# EAGLE schematic BoB Brain v03 (EAGLE 7.5.0)

## Sheet 1 of 2: LED Controller
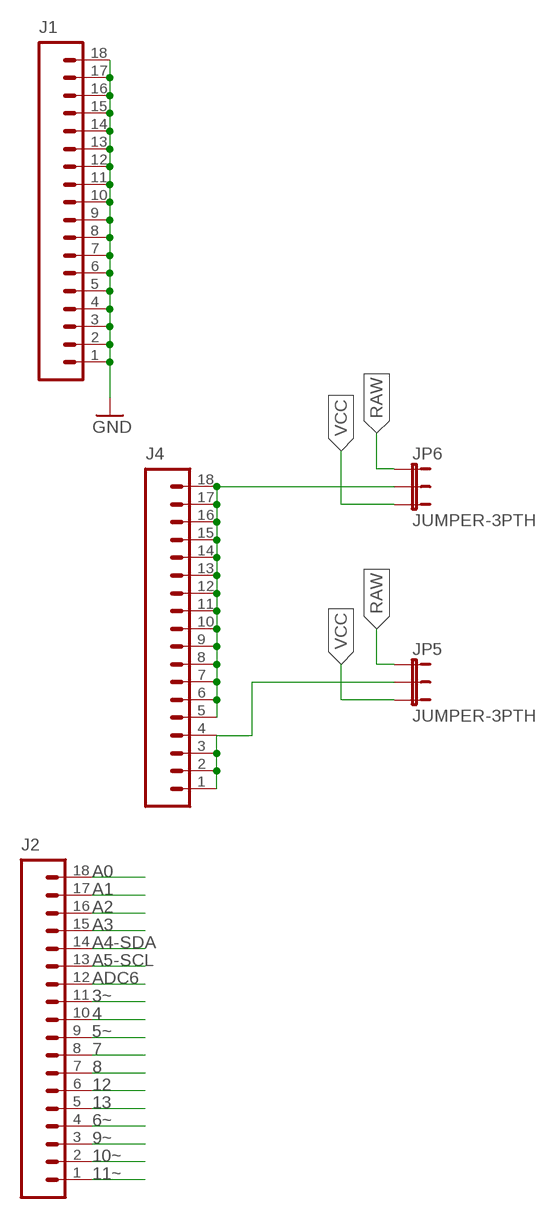
[diagram p0: schematic, sheet 1]

### Parts
J1  M18_  [1X18]
J2  M18_  [1X18]
J4  M18_  [1X18]
JP5  JUMPER-3PTH  [1X03]
JP6  JUMPER-3PTH  [1X03]

### Nets
3~: J2.18 ; also sheet 2
4: J2.17 ; also sheet 2
5~: J2.9 ; also sheet 2
6V: J4.5 J4.6 J4.7 J4.8 J4.9 J4.10 J4.11 J4.12 J4.13 J4.14 J4.15 J4.16 J4.17 J4.18 JP6.2
6~: J2.4 ; also sheet 2
7: J2.8 ; also sheet 2
8: J2.7 ; also sheet 2
9~: J2.3 ; also sheet 2
10~: J2.2 ; also sheet 2
11~: J2.1 ; also sheet 2
12: J2.6 ; also sheet 2
13: J2.5 ; also sheet 2
A0: J2.12 ; also sheet 2
A1: J2.10
A2: J2.16
A3: J2.15 ; also sheet 2
A4-SDA: J2.14 ; also sheet 2
A5-SCL: J2.13 ; also sheet 2
ADC6: J2.11 ; also sheet 2
GND: J1.1 J1.2 J1.3 J1.4 J1.5 J1.6 J1.7 J1.8 J1.9 J1.10 J1.11 J1.12 J1.13 J1.14 J1.15 J1.16 J1.17 J1.18 ; also sheet 2
PIN_PWR: J4.1 J4.2 J4.3 J4.4 JP5.2
RAW: JP5.1 JP6.1 ; also sheet 2
VCC: JP5.3 JP6.3 ; also sheet 2

## Sheet 2 of 2: My Arduino
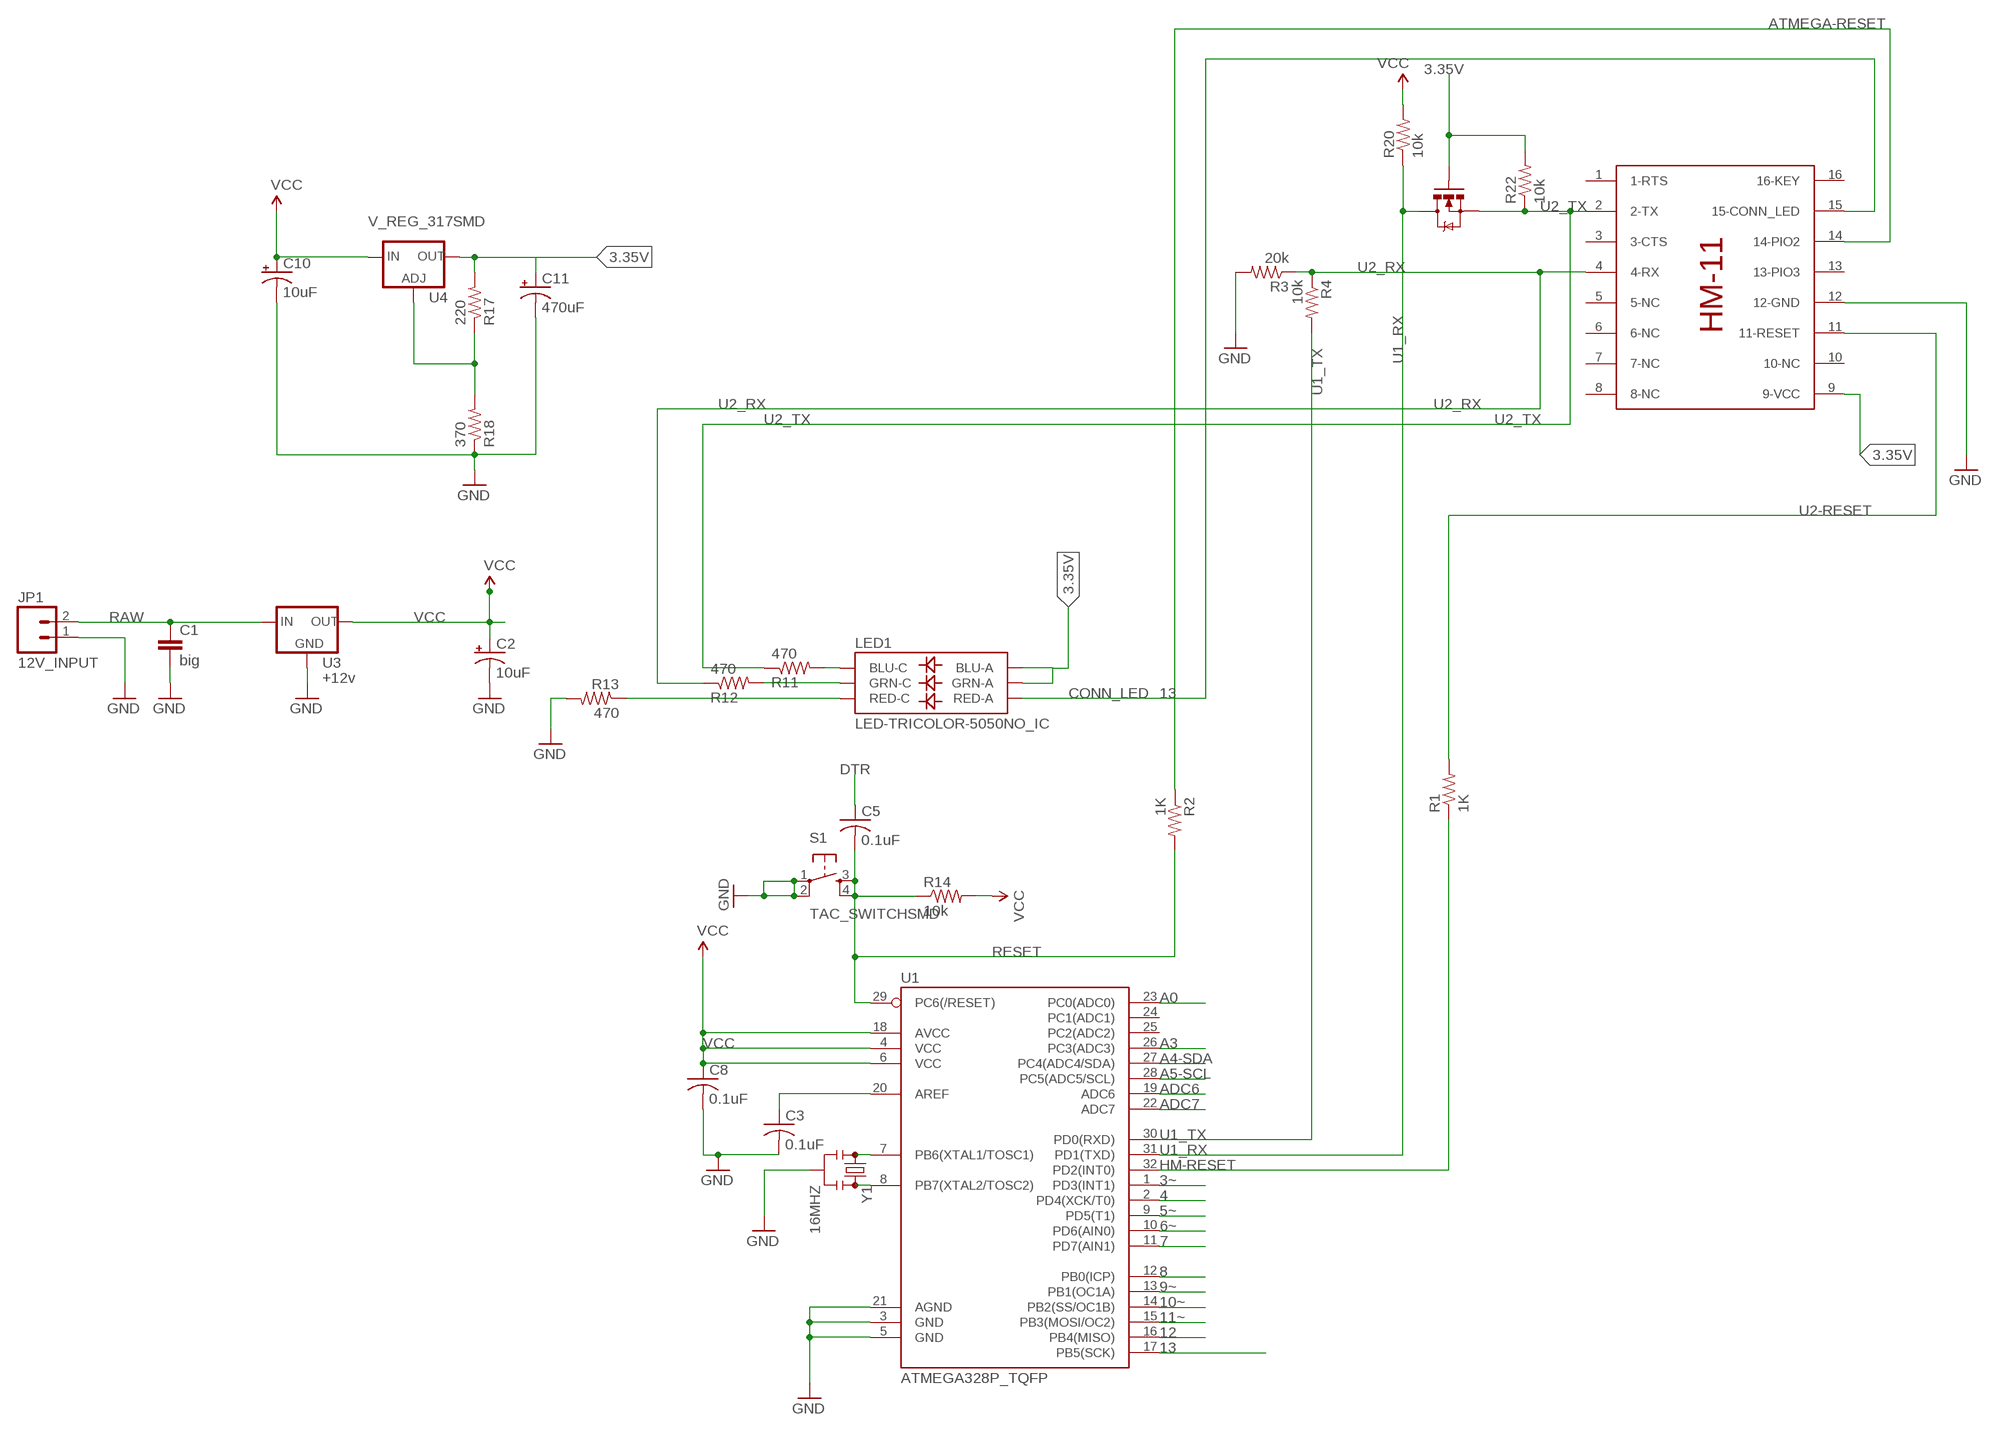
[diagram p1: schematic, sheet 2]

### Parts
C1  big  CAPPTH1  [CAP-PTH-5MM]
C2  10uF  CAP_POL3528  [EIA3528]
C3  0.1uF  C-USC0402  [C0402]
C5  0.1uF  C-USC0805K  [C0805K]
C8  0.1uF  C-USC0402  [C0402]
C10  10uF  CAP_POL3528  [EIA3528]
C11  470uF  CPOL-USD/7343-31W  [D/7343-31W]
JP1  12V_INPUT  M025MM  [SCREWTERMINAL-5MM-2]
LED1  LED-TRICOLOR-5050NO_IC  [LED-TRICOLOR-5050]
Q1  MOSFET-NCHANNELAO3404A  [SOT23-3]
R1  1K  R-US_R0805W  [R0805W]
R2  1K  R-US_R0805W  [R0805W]
R3  20k  R-US_R0805W  [R0805W]
R4  10k  R-US_R0805W  [R0805W]
R11  470  R-US_R0805W  [R0805W]
R12  470  R-US_R0805W  [R0805W]
R13  470  R-US_R0805W  [R0805W]
R14  10k  R-US_R0805W  [R0805W]
R17  220  R-US_R0805W  [R0805W]
R18  370  R-US_R0805W  [R0805W]
R20  10k  R-US_R0805W  [R0805W]
R22  10k  R-US_R0805W  [R0805W]
S1  TAC_SWITCHSMD  [TACTILE-SWITCH-SMD]
U1  ATMEGA328P_TQFP  [TQFP32-08]
U3  +12v  V_REG_78XX7812  [TO-252]
U4  V_REG_317SMD  [SOT223]
U$1  HM-11  [HM-11]
Y1  16MHZ  RESONATOR16MHZ  [RESONATOR-SMD]

### Nets
3.35V: C11.+ LED1.1(GRN-A) LED1.3(BLU-A) Q1.1(G) R17.2 R22.2 U4.2(OUT) U$1.9(9-VCC)
3~: U1.1(PD3(INT1)) ; also sheet 1
4: U1.2(PD4(XCK/T0)) ; also sheet 1
5~: U1.9(PD5(T1)) ; also sheet 1
6~: U1.10(PD6(AIN0)) ; also sheet 1
7: U1.11(PD7(AIN1)) ; also sheet 1
8: U1.12(PB0(ICP)) ; also sheet 1
9~: U1.13(PB1(OC1A)) ; also sheet 1
10~: U1.14(PB2(SS/OC1B)) ; also sheet 1
11~: U1.15(PB3(MOSI/OC2)) ; also sheet 1
12: U1.16(PB4(MISO)) ; also sheet 1
13: U1.17(PB5(SCK)) ; also sheet 1
A0: U1.23(PC0(ADC0)) ; also sheet 1
A3: U1.26(PC3(ADC3)) ; also sheet 1
A4-SDA: U1.27(PC4(ADC4/SDA)) ; also sheet 1
A5-SCL: U1.28(PC5(ADC5/SCL)) ; also sheet 1
ADC6: U1.19(ADC6) ; also sheet 1
ADC7: U1.22(ADC7)
AREF: C3.1 U1.20(AREF)
ATMEGA-RESET: R2.1 U$1.14(14-PIO2)
CONN_LED: LED1.2(RED-A) U$1.15(15-CONN_LED)
DTR: C5.1
GND: C1.2 C2.C(-) C3.2 C8.2 C10.C(-) C11.- JP1.1 R3.2 R13.2 R18.1 S1.1 S1.2 U1.3(GND) U1.5(GND) U1.21(AGND) U3.3(GND) U$1.12(12-GND) Y1.2 ; also sheet 1
HM-RESET: R1.1 U1.32(PD2(INT0))
N$1: LED1.5(RED-C) R13.1
N$2: U1.7(PB6(XTAL1/TOSC1)) Y1.1
N$3: LED1.4(BLU-C) R11.2
N$4: LED1.6(GRN-C) R12.2
N$11: U1.8(PB7(XTAL2/TOSC2)) Y1.3
N$14: R17.1 R18.2 U4.1(ADJ)
RAW: C1.1 JP1.2 U3.1(IN) ; also sheet 1
RESET: C5.2 R2.2 R14.1 S1.3 S1.4 U1.29(PC6(/RESET))
U1_RX: Q1.3(D) R20.1 U1.31(PD1(TXD))
U1_TX: R4.2 U1.30(PD0(RXD))
U2-RESET: R1.2 U$1.11(11-RESET)
U2_RX: R3.1 R4.1 R12.1 U$1.4(4-RX)
U2_TX: Q1.2(S) R11.1 R22.1 U$1.2(2-TX)
VCC: C2.A(+) C8.1 C10.A(+) R14.2 R20.2 U1.4(VCC) U1.6(VCC) U1.18(AVCC) U3.2(OUT) U4.3(IN) ; also sheet 1
Unconnected: U1.24(PC1(ADC1)) U1.25(PC2(ADC2)) U$1.1(1-RTS) U$1.3(3-CTS) U$1.5(5-NC) U$1.6(6-NC) U$1.7(7-NC) U$1.8(8-NC) U$1.10(10-NC) U$1.13(13-PIO3) U$1.16(16-KEY)

## Library data of the parts
C1 = SparkFun-Passives:CAP: Capacitor Standard 0603 ceramic capacitor, and 0.1" leaded capacitor.
C2 C10 = SparkFun-Capacitors:CAP_POL: Capacitor Polarized These are standard SMD and PTH capacitors. Normally 10uF, 47uF, and 100uF in electrolytic and tantalum varieties. Always verify the external diameter of the through hole cap, it varies with capacity, voltage, and manufacturer. The EIA devices should be standard.
C3 C5 C8 = resistor:C-US: CAPACITOR, American symbol
C11 = resistor:CPOL-US: POLARIZED CAPACITOR, American symbol
J1 J2 J4 = SparkFun-Connectors:M18: 1x18 .1" header
JP1 = SparkFun-Connectors:M02: Standard 2-pin 0.1" header. Use with - straight break away headers ( PRT-00116) - right angle break away headers (PRT-00553) - swiss pins (PRT-00743) - machine pins (PRT-00117) - female headers (PRT-00115) Molex polarized connector foot print use with: PRT-08233 with associated crimp pins and housings. 2.54_SCREWTERM for use with PRT-10571. 3.5mm Screw Terminal footprints for PRT-08084 5mm Screw Terminal footprints for use with PRT-08432; STOREFRONT_ID: PRT-08432
JP5 JP6 = SparkFun-Retired:JUMPER-3
LED1 = SparkFun-LED:LED-TRICOLOR-5050
Q1 = SparkFun-DiscreteSemi:MOSFET-NCHANNEL: Common NMOSFET Parts MFG P/N Store ID Prod ID FDD8780 TRANS-09984 SI7820DN TRANS-11055 FDS6630A IC-08089 2N7002PW TRANS-11151 FQP30N06L COM-10213 TRANS-10060 BSS123LT1G TRANS-08345 BSS138 TRANS-00830 BS170 2N7000; PROD_ID: TRAN-12988
R1-R4 R11-R14 R17 R18 R20 R22 = resistor:R-US_: RESISTOR, American symbol
S1 = SparkFun-Retired:TAC_SWITCH: Momentary Switch Button commonly used for reset or general input. Spark Fun Electronics SKU : COM-00097 SMT- SWCH-08247; PROD_ID: SWCH-08247
U1 = SparkFun-DigitalIC:ATMEGA328P_TQFP; PROD_ID: IC-09069
U3 = SparkFun-PowerIC:V_REG_78XX: Voltage Regulator Standard 78xx regulator. IGO (Input Ground Output). Spark Fun Electronics SKU : COM-00107; PROD_ID: VREG-12370
U4 = SparkFun-PowerIC:V_REG_317: Voltage Regulator Standard LM317 adjustable voltage regulator. AOI (Adjust Output Input). Google 'LM317 Calculator' for easy to use app to get the two resistor values needed. 240/720 for 5V output. 240/390 for 3.3V output. Spark Fun Electronics SKU : COM-00527
U$1 = HM-11-ladvien:HM-11
Y1 = SparkFun-FreqCtrl:RESONATOR: Resonator Small SMD resonator. Used, eg, on the Arduino Pro/ Pro Mini boards. 8MHz- XTAL-08895 16MHz- XTAL-08900; PROD_ID: XTAL-08900